# Altium schematic sheet MCU_EM.SchDoc
size A
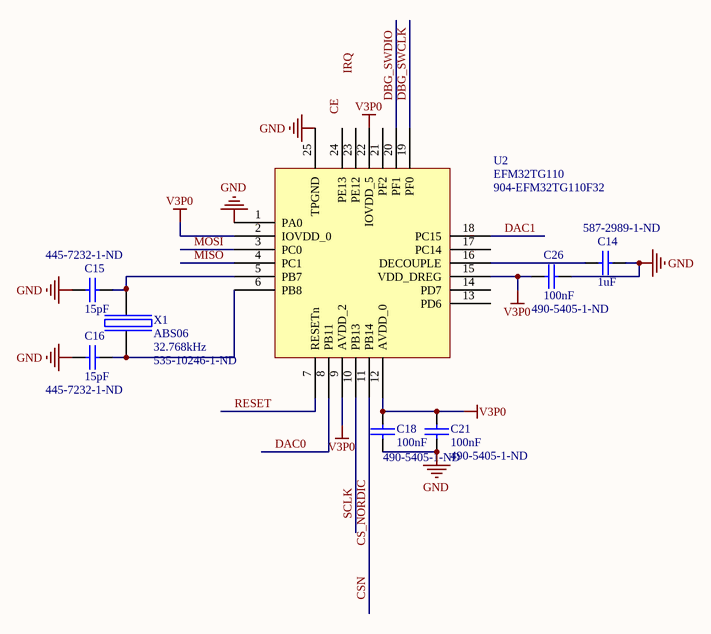
[diagram p0: MCU_EM.SchDoc]

## Parts
C14  value 1uF  Supplier Part Number 1: 587-2989-1-ND  [0402s]  (hidden comment: NP0 4V)
C15  value 15pF  Supplier Part Number 1: 445-7232-1-ND  [0201]  (hidden comment: NP0 50V)
C16  value 15pF  Supplier Part Number 1: 445-7232-1-ND  [0201]  (hidden comment: NP0 50V)
C18  value 100nF  Supplier Part Number 1: 490-5405-1-ND  [0201]  (hidden comment: NP0 10V)
C21  value 100nF  Supplier Part Number 1: 490-5405-1-ND  [0201]  (hidden comment: NP0 10V)
C26  value 100nF  Supplier Part Number 1: 490-5405-1-ND  [0402s]  (hidden comment: NP0 10V)
U2  EFM32TG110  Supplier Part Number 1: 904-EFM32TG110F32  [QFN24_EM]
X1  ABS06  Frequency: 32.768kHz  Supplier Part Number 1: 535-10246-1-ND  [ABS06]

## Nets
GND: C14.1 C15.1 C16.2 C18.2 C21.2 C26.2 U2.1(PA0) U2.25(TPGND)
V3P0: C18.1 C21.1 C26.1 U2.2(IOVDD_0) U2.9(AVDD_2) U2.12(AVDD_0) U2.15(VDD_DREG) U2.22(IOVDD_5)
CS_NORDIC: U2.11(PB14)  [also labelled CSN]
DAC0: U2.8(PB11)
DAC1: U2.18(PC15)
DBG_SWCLK: U2.19(PF0)
DBG_SWDIO: U2.20(PF1)
MISO: U2.4(PC1)
MOSI: U2.3(PC0)
RESET: U2.7(RESETn)
SCLK: U2.10(PB13)
NetC14_2: C14.2 U2.16(DECOUPLE)
NetC15_2: C15.2 U2.5(PB7) X1.1(inp)
NetC16_1: C16.1 U2.6(PB8) X1.2(out)

Not connected (* = marked no-connect by the designer): U2 13(PD6) 14(PD7) 17(PC14) 21(PF2) 23(PE12) 24(PE13)

## Notes on the sheet
- Labels drawn without touching a wire or pin: CE, IRQ

## Library data of the parts
C14 = Cap: Capacitor; Manufacturer: Taiyo Yuden; Manufacturer Part Number: AMK063ABJ105MP-F; Description: CAP CER 1UF 4V 20% X5R 0201; Capacitance: 1.0µF; Tolerance: ±20%; Temperature Coefficient: X5R; Supplier 1: Digi-Key; RoHS: RoHS Compliant; Category: Capacitors; Stock 1: 25231; Pricing 1: 1=0.56, 10=0.469, 50=0.336, 100=0.294, 250=0.231, 500=0.21, 1000=0.168, 5000=0.1295 (USD); Voltage - Rated: 4V; Mounting Type: Surface Mount, MLCC; Operating Temperature: -55°C ~ 85°C; Applications: General Purpose; Ratings: -; Package / Case: 0201 (0603 Metric); Size / Dimension: 0.024" L x 0.012" W (0.60mm x 0.30mm); Height - Seated (Max): -; Thickness (Max): 0.013" (0.33mm); Lead Spacing: -; Features: -; Packaging: Cut Tape (CT); Lead Style: -; ComponentLink1URL: http://www.yuden.co.jp/ut/product/pdf/mlcc01_e.pdf; ComponentLink1Description: http://www.yuden.co.jp/ut/product/pdf/mlcc01_e.pdf
C15 C16 = Cap: Capacitor; Part Field 1: 0402; Manufacturer: TDK Corporation; Manufacturer Part Number: C0603C0G1E150G; Description: CAP CER 15PF 25V 2% NP0 0201; Voltage - Rated: 25V; Tolerance: ±2%; Temperature Coefficient: C0G, NP0; Supplier 1: Digi-Key; RoHS: RoHS Compliant; Category: Capacitors; Stock 1: 29640; Pricing 1: 1=0.15, 10=0.093, 100=0.0333, 250=0.02404, 500=0.01776, 1000=0.01203 (USD); Capacitance: 15pF; Mounting Type: Surface Mount, MLCC; Operating Temperature: -55°C ~ 125°C; Applications: General Purpose; Ratings: -; Package / Case: 0201 (0603 Metric); Size / Dimension: 0.024" L x 0.012" W (0.60mm x 0.30mm); Height - Seated (Max): -; Thickness (Max): 0.013" (0.33mm); Lead Spacing: -; Features: -; Packaging: Cut Tape (CT); Lead Style: -; ComponentLink1URL: http://www.tdk.com/pdf/general_B11.pdf; ComponentLink1Description: http://www.tdk.com/pdf/general_B11.pdf
C18 C21 C26 = Cap: Capacitor; Part Field 1: 0402; Manufacturer: Murata Electronics North America; Manufacturer Part Number: GRM033R61A104ME15D; Description: CAP CER 0.1UF 10V 20% X5R 0201; Capacitance: 0.1µF; Tolerance: ±20%; Temperature Coefficient: X5R; Supplier 1: Digi-Key; RoHS: RoHS Compliant; Category: Capacitors; Stock 1: 1087710; Pricing 1: 10=0.05, 50=0.0396, 100=0.0297, 250=0.02144, 500=0.01584, 1000=0.01073, 5000=0.00825 (USD); Voltage - Rated: 10V; Mounting Type: Surface Mount, MLCC; Operating Temperature: -55°C ~ 85°C; Applications: General Purpose; Ratings: -; Package / Case: 0201 (0603 Metric); Size / Dimension: 0.024" L x 0.012" W (0.60mm x 0.30mm); Height - Seated (Max): -; Thickness (Max): 0.013" (0.33mm); Lead Spacing: -; Features: -; Packaging: Cut Tape (CT); Lead Style: -; ComponentLink1URL: http://www.murata.com/products/catalog/pdf/c02e.pdf; ComponentLink1Description: http://www.murata.com/products/catalog/pdf/c02e.pdf
U2 = EFM32TG110: EFM32TG110F32; Manufacturer: Energy Micro; Description: Microcontrollers (MCU) 32KB Flash 4KB RAM; Program Memory Type: Flash; Data RAM Size: 32 KB; Interface Type: UART, I2C, SPI; Core: ARM Cortex M3; Data Bus Width: 32 bit; Maximum Clock Frequency: 32 MHz; Number of Programmable I/Os: 17; Number of Timers: 1; Operating Supply Voltage: 1.8 V to 3.8 V; Processor Series: EFM32; Product Status: New Technology; Supplier 1: Mouser; Manufacturer Part Number: EFM32TG110F32; RoHS: RoHS Compliant; Category: Microcontrollers (MCU); Stock 1: 0; Pricing 1: 1=5.13, 10=4.66, 25=4.27, 100=3.87, 250=3.48, 500=3.20, 1000=2.61 (AUD); Package / Case: QFN-24; Mounting Style: SMD/SMT; Program Memory Size: 32 KB; Maximum Operating Temperature: + 85 C; RoHS - Mouser: Y; Minimum Order Quantity: 1; Reeling: False; ComponentLink1URL: http://cdn.energymicro.com/dl/devices/pdf/d0013_efm32tg110_datasheet.pdf; ComponentLink1Description: http://cdn.energymicro.com/dl/devices/pdf/d0013_efm32tg110_datasheet.pdf
X1 = ABS06: Manufacturer: Abracon Corporation; Manufacturer Part Number: ABS06-32.768KHZ-9-T; Description: CRYSTAL 32.768 KHZ 9.0 PF SMD; Frequency Tolerance: ±20ppm; Load Capacitance: 9pF; Operating Mode: Fundamental; Supplier 1: Digi-Key; RoHS: RoHS Compliant; Category: Crystals and Oscillators; Stock 1: 7776; Pricing 1: 1=2.55, 10=2.21, 50=1.938, 100=1.53, 500=1.292 (USD); Type: kHz Crystal (Tuning Fork); Frequency Stability: -; Operating Temperature: -40°C ~ 85°C; Mounting Type: Surface Mount; Package / Case: 2-SMD; Size / Dimension: 0.079" L x 0.047" W (2.00mm x 1.20mm); Height: 0.024" (0.60mm); Packaging: Cut Tape (CT); ComponentLink1URL: http://www.abracon.com/Resonators/ABS06.pdf; ComponentLink1Description: http://www.abracon.com/Resonators/ABS06.pdf